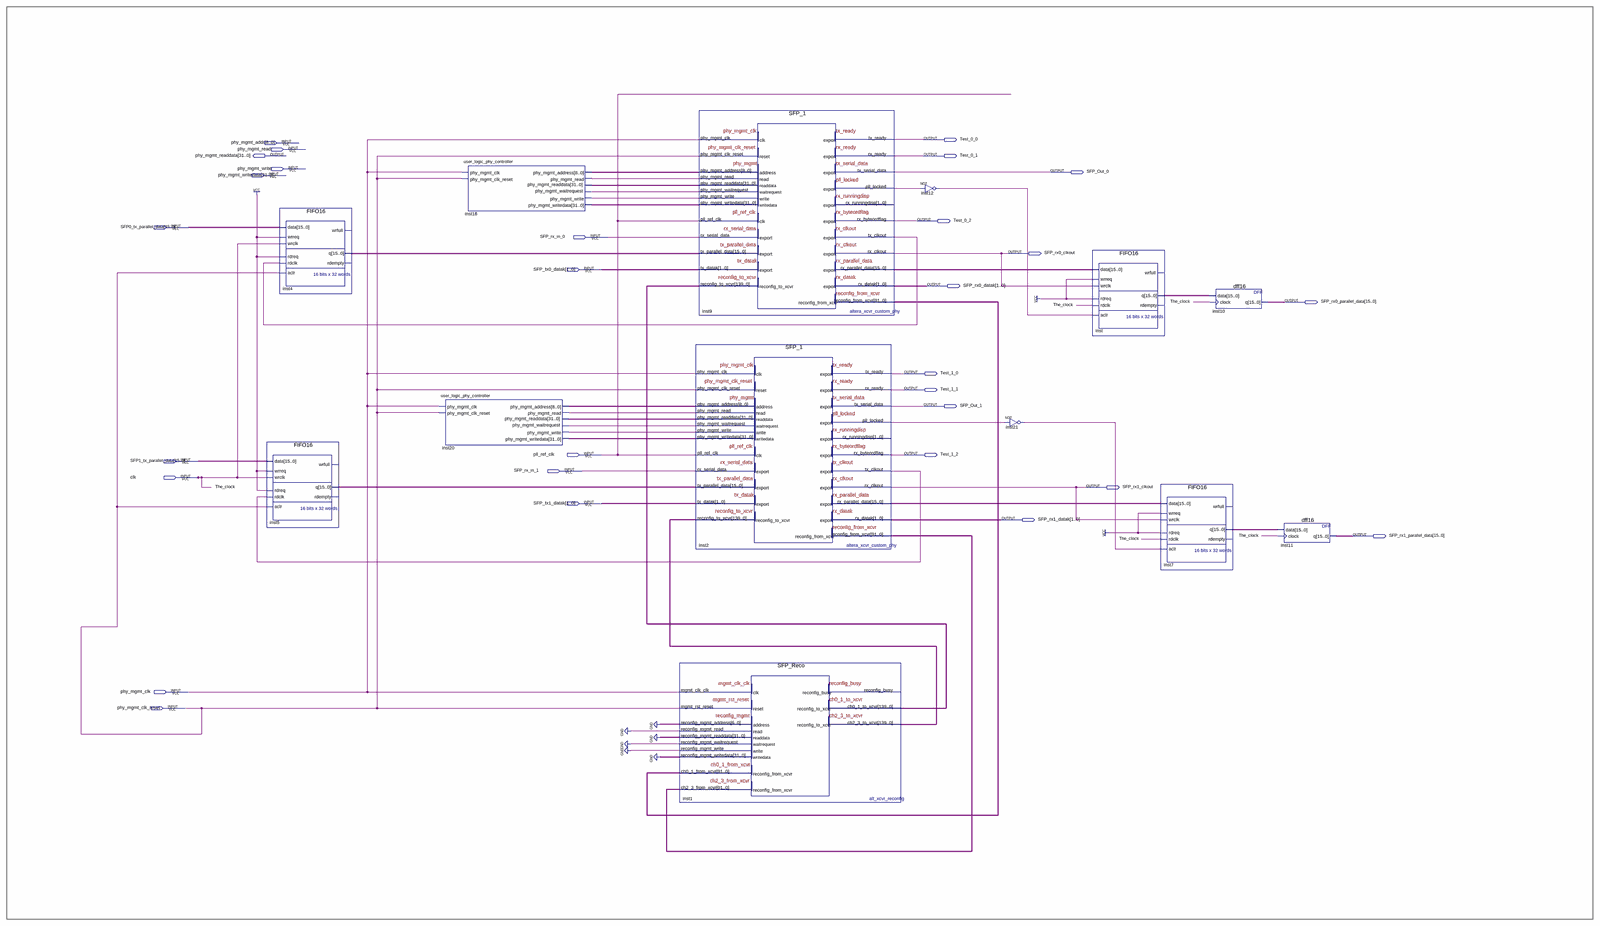
[diagram p0: schematic sheet, whole]
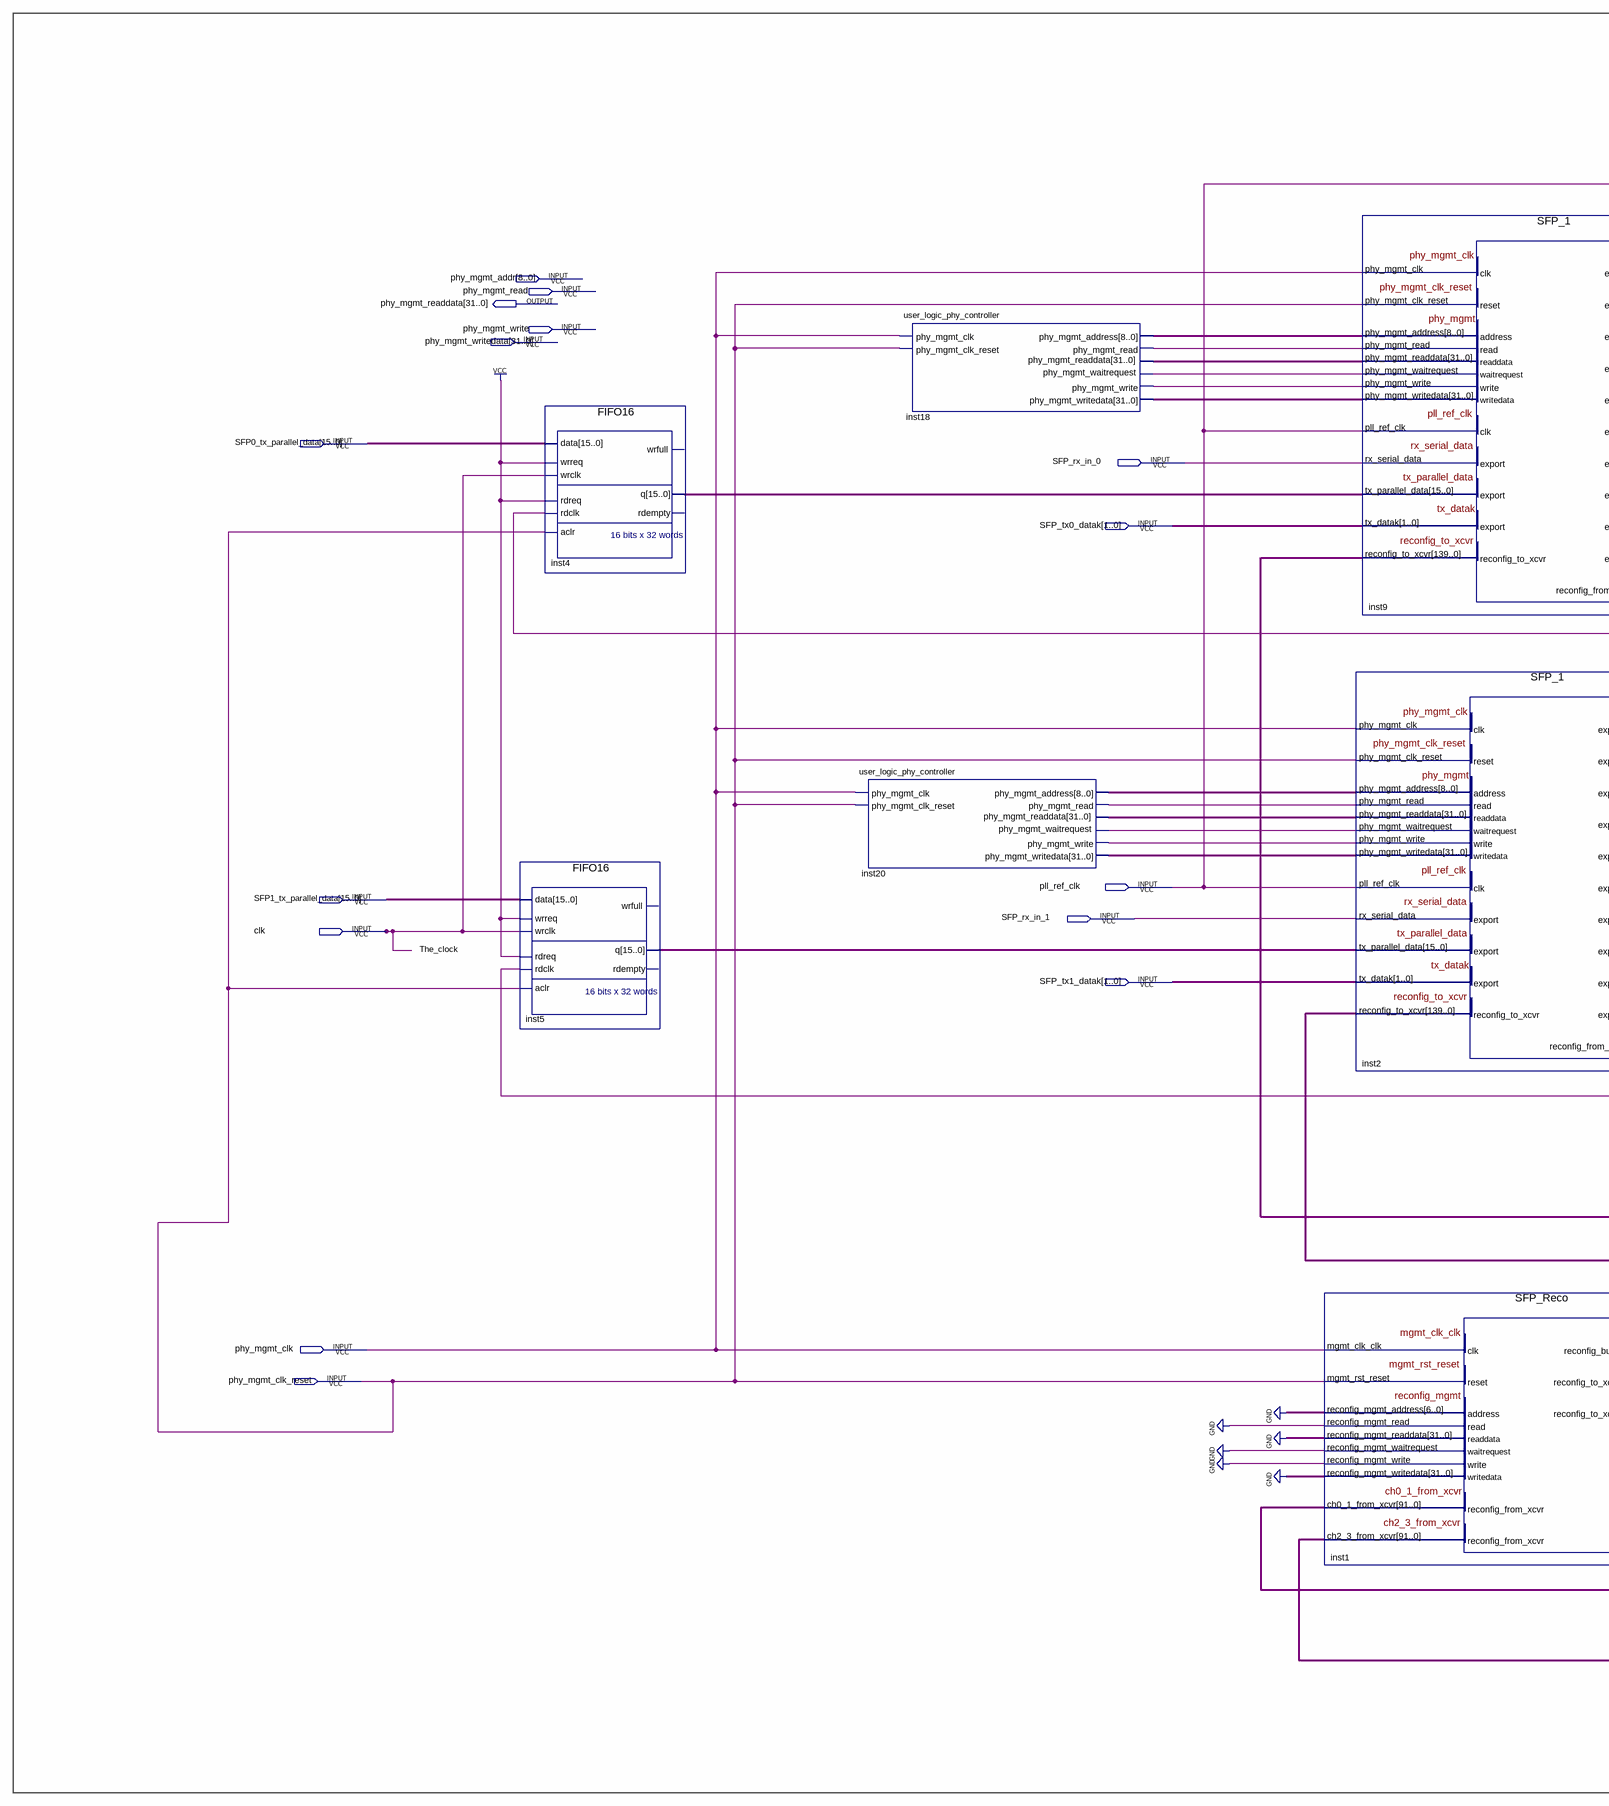
[diagram p1: schematic sheet, left part]
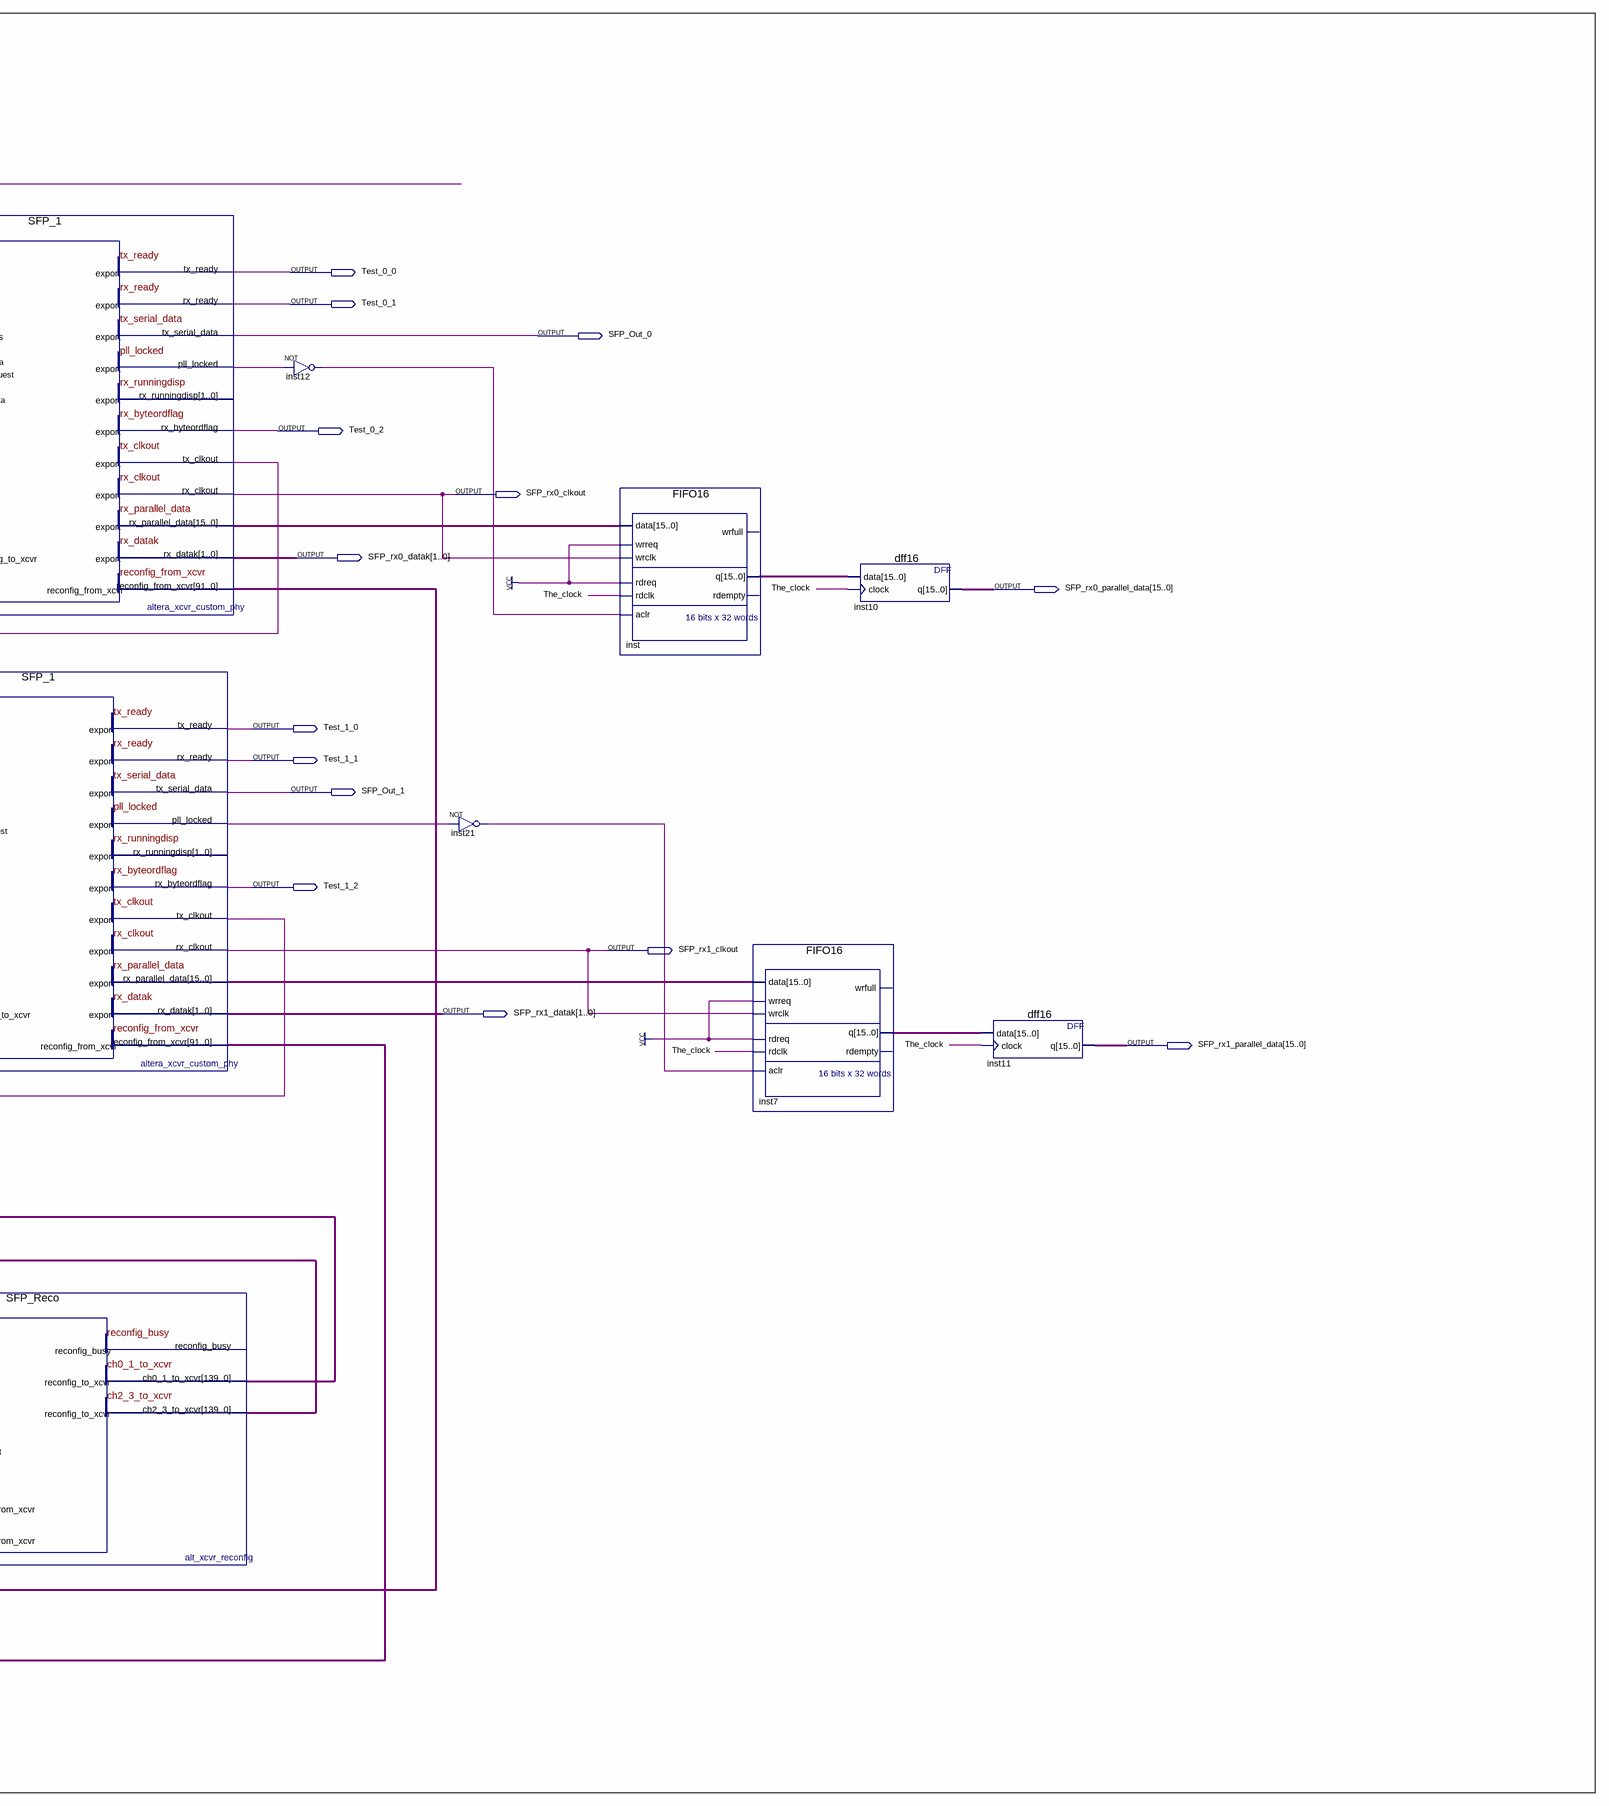
[diagram p2: schematic sheet, right part]
// Quartus schematic SFP_GxBlock.bdf as structural Verilog: 13 symbols, 29 pins
module SFP_GxBlock (
  input  [8:0] phy_mgmt_addr,
  input  phy_mgmt_read,
  input  phy_mgmt_write,
  input  [31:0] phy_mgmt_writedata,
  input  [15:0] SFP0_tx_parallel_data,
  input  SFP_rx_in_0,
  input  [1:0] SFP_tx0_datak,
  input  pll_ref_clk,
  input  [15:0] SFP1_tx_parallel_data,
  input  SFP_rx_in_1,
  input  clk,
  input  [1:0] SFP_tx1_datak,
  input  phy_mgmt_clk,
  input  phy_mgmt_clk_reset,
  output Test_0_0,
  output [31:0] phy_mgmt_readdata,
  output Test_0_1,
  output SFP_Out_0,
  output Test_0_2,
  output SFP_rx0_clkout,
  output [1:0] SFP_rx0_datak,
  output [15:0] SFP_rx0_parallel_data,
  output Test_1_0,
  output Test_1_1,
  output SFP_Out_1,
  output Test_1_2,
  output SFP_rx1_clkout,
  output [1:0] SFP_rx1_datak,
  output [15:0] SFP_rx1_parallel_data
);

  wire inst1_reconfig_mgmt_waitrequest, inst2_phy_mgmt_waitrequest, inst2_pll_locked, inst2_tx_clkout,
       inst9_phy_mgmt_waitrequest, inst9_pll_locked, inst9_tx_clkout, inst12_out, inst18_phy_mgmt_read,
       inst18_phy_mgmt_write, inst20_phy_mgmt_read, inst20_phy_mgmt_write, inst21_out;
  wire [8:0] inst18_phy_mgmt_address, inst20_phy_mgmt_address;
  wire [15:0] inst2_rx_parallel_data, inst4_q, inst5_q, inst7_q, inst9_rx_parallel_data, inst_q;
  wire [31:0] inst1_reconfig_mgmt_readdata, inst2_phy_mgmt_readdata, inst9_phy_mgmt_readdata,
       inst18_phy_mgmt_writedata, inst20_phy_mgmt_writedata;
  wire [91:0] inst2_reconfig_from_xcvr, inst9_reconfig_from_xcvr;
  wire [139:0] inst1_ch0_1_to_xcvr, inst1_ch2_3_to_xcvr;

  FIFO16 inst4 (
    .data(SFP0_tx_parallel_data), .wrreq(1'b1), .wrclk(clk), .rdreq(1'b1), .rdclk(inst9_tx_clkout),
    .aclr(phy_mgmt_clk_reset), .q(inst4_q));  // open: wrfull, rdempty
  FIFO16 inst5 (
    .data(SFP1_tx_parallel_data), .wrreq(1'b1), .wrclk(clk), .rdreq(1'b1), .rdclk(inst2_tx_clkout),
    .aclr(phy_mgmt_clk_reset), .q(inst5_q));  // open: wrfull, rdempty
  user_logic_phy_controller inst18 (
    .phy_mgmt_clk(phy_mgmt_clk), .phy_mgmt_clk_reset(phy_mgmt_clk_reset),
    .phy_mgmt_readdata(inst9_phy_mgmt_readdata), .phy_mgmt_waitrequest(inst9_phy_mgmt_waitrequest),
    .phy_mgmt_address(inst18_phy_mgmt_address), .phy_mgmt_read(inst18_phy_mgmt_read),
    .phy_mgmt_write(inst18_phy_mgmt_write), .phy_mgmt_writedata(inst18_phy_mgmt_writedata));
  user_logic_phy_controller inst20 (
    .phy_mgmt_clk(phy_mgmt_clk), .phy_mgmt_clk_reset(phy_mgmt_clk_reset),
    .phy_mgmt_readdata(inst2_phy_mgmt_readdata), .phy_mgmt_waitrequest(inst2_phy_mgmt_waitrequest),
    .phy_mgmt_address(inst20_phy_mgmt_address), .phy_mgmt_read(inst20_phy_mgmt_read),
    .phy_mgmt_write(inst20_phy_mgmt_write), .phy_mgmt_writedata(inst20_phy_mgmt_writedata));
  SFP_1 inst2 (
    .phy_mgmt_clk(phy_mgmt_clk), .phy_mgmt_clk_reset(phy_mgmt_clk_reset),
    .phy_mgmt_address(inst20_phy_mgmt_address), .phy_mgmt_read(inst20_phy_mgmt_read),
    .phy_mgmt_write(inst20_phy_mgmt_write), .phy_mgmt_writedata(inst20_phy_mgmt_writedata),
    .pll_ref_clk(pll_ref_clk), .rx_serial_data(SFP_rx_in_1), .tx_parallel_data(inst5_q),
    .tx_datak(SFP_tx1_datak), .reconfig_to_xcvr(inst1_ch2_3_to_xcvr),
    .phy_mgmt_readdata(inst2_phy_mgmt_readdata), .phy_mgmt_waitrequest(inst2_phy_mgmt_waitrequest),
    .tx_ready(Test_1_0), .rx_ready(Test_1_1), .tx_serial_data(SFP_Out_1), .pll_locked(inst2_pll_locked),
    .rx_byteordflag(Test_1_2), .tx_clkout(inst2_tx_clkout), .rx_clkout(SFP_rx1_clkout),
    .rx_parallel_data(inst2_rx_parallel_data), .rx_datak(SFP_rx1_datak),
    .reconfig_from_xcvr(inst2_reconfig_from_xcvr));  // open: rx_runningdisp
  SFP_Reco inst1 (
    .mgmt_clk_clk(phy_mgmt_clk), .mgmt_rst_reset(phy_mgmt_clk_reset), .reconfig_mgmt_address({7{1'b0}}),
    .reconfig_mgmt_read(1'b0), .reconfig_mgmt_write(1'b0), .reconfig_mgmt_writedata({32{1'b0}}),
    .ch0_1_from_xcvr(inst9_reconfig_from_xcvr), .ch2_3_from_xcvr(inst2_reconfig_from_xcvr),
    .reconfig_mgmt_readdata(inst1_reconfig_mgmt_readdata),
    .reconfig_mgmt_waitrequest(inst1_reconfig_mgmt_waitrequest), .ch0_1_to_xcvr(inst1_ch0_1_to_xcvr),
    .ch2_3_to_xcvr(inst1_ch2_3_to_xcvr));  // open: reconfig_busy
  SFP_1 inst9 (
    .phy_mgmt_clk(phy_mgmt_clk), .phy_mgmt_clk_reset(phy_mgmt_clk_reset),
    .phy_mgmt_address(inst18_phy_mgmt_address), .phy_mgmt_read(inst18_phy_mgmt_read),
    .phy_mgmt_write(inst18_phy_mgmt_write), .phy_mgmt_writedata(inst18_phy_mgmt_writedata),
    .pll_ref_clk(pll_ref_clk), .rx_serial_data(SFP_rx_in_0), .tx_parallel_data(inst4_q),
    .tx_datak(SFP_tx0_datak), .reconfig_to_xcvr(inst1_ch0_1_to_xcvr),
    .phy_mgmt_readdata(inst9_phy_mgmt_readdata), .phy_mgmt_waitrequest(inst9_phy_mgmt_waitrequest),
    .tx_ready(Test_0_0), .rx_ready(Test_0_1), .tx_serial_data(SFP_Out_0), .pll_locked(inst9_pll_locked),
    .rx_byteordflag(Test_0_2), .tx_clkout(inst9_tx_clkout), .rx_clkout(SFP_rx0_clkout),
    .rx_parallel_data(inst9_rx_parallel_data), .rx_datak(SFP_rx0_datak),
    .reconfig_from_xcvr(inst9_reconfig_from_xcvr));  // open: rx_runningdisp
  not inst12 (inst12_out, inst9_pll_locked);
  not inst21 (inst21_out, inst2_pll_locked);
  FIFO16 inst (
    .data(inst9_rx_parallel_data), .wrreq(1'b1), .wrclk(SFP_rx0_clkout), .rdreq(1'b1), .rdclk(clk),
    .aclr(inst12_out), .q(inst_q));  // open: wrfull, rdempty
  FIFO16 inst7 (
    .data(inst2_rx_parallel_data), .wrreq(1'b1), .wrclk(SFP_rx1_clkout), .rdreq(1'b1), .rdclk(clk),
    .aclr(inst21_out), .q(inst7_q));  // open: wrfull, rdempty
  dff16 inst10 (.data(inst_q), .clock(clk), .q(SFP_rx0_parallel_data));
  dff16 inst11 (.data(inst7_q), .clock(clk), .q(SFP_rx1_parallel_data));
  // also tied to GND on the sheet: {inst1_reconfig_mgmt_waitrequest, inst1_reconfig_mgmt_readdata[0], inst1_reconfig_mgmt_readdata[1], inst1_reconfig_mgmt_readdata[2], inst1_reconfig_mgmt_readdata[3], inst1_reconfig_mgmt_readdata[4], inst1_reconfig_mgmt_readdata[5], inst1_reconfig_mgmt_readdata[6], inst1_reconfig_mgmt_readdata[7], inst1_reconfig_mgmt_readdata[8], inst1_reconfig_mgmt_readdata[9], inst1_reconfig_mgmt_readdata[10], inst1_reconfig_mgmt_readdata[11], inst1_reconfig_mgmt_readdata[12], inst1_reconfig_mgmt_readdata[13], inst1_reconfig_mgmt_readdata[14], inst1_reconfig_mgmt_readdata[15], inst1_reconfig_mgmt_readdata[16], inst1_reconfig_mgmt_readdata[17], inst1_reconfig_mgmt_readdata[18], inst1_reconfig_mgmt_readdata[19], inst1_reconfig_mgmt_readdata[20], inst1_reconfig_mgmt_readdata[21], inst1_reconfig_mgmt_readdata[22], inst1_reconfig_mgmt_readdata[23], inst1_reconfig_mgmt_readdata[24], inst1_reconfig_mgmt_readdata[25], inst1_reconfig_mgmt_readdata[26], inst1_reconfig_mgmt_readdata[27], inst1_reconfig_mgmt_readdata[28], inst1_reconfig_mgmt_readdata[29], inst1_reconfig_mgmt_readdata[30], inst1_reconfig_mgmt_readdata[31]}

  // Other names for the same wires on the sheet: The_clock = clk
endmodule
